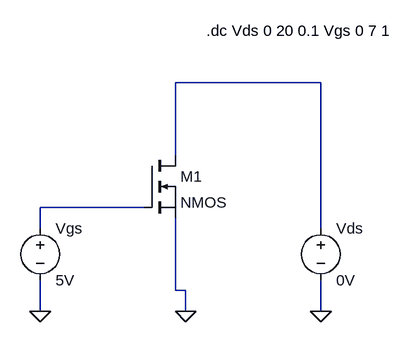
[diagram p0: schematic task 2.asc]
task 2.asc, the LTspice schematic file:
Version 4
SHEET 1 880 680
WIRE 400 0 176 0
WIRE 176 112 176 0
WIRE 128 192 -32 192
WIRE -32 224 -32 192
WIRE 400 224 400 0
WIRE 176 320 176 208
WIRE 192 320 176 320
WIRE -32 352 -32 304
WIRE 192 352 192 320
WIRE 400 352 400 304
FLAG -32 352 0
FLAG 192 352 0
FLAG 400 352 0
SYMBOL nmos 128 112 R0
SYMATTR InstName M1
SYMBOL voltage -32 208 R0
SYMATTR InstName Vgs
SYMATTR Value 5V
SYMBOL voltage 400 208 R0
SYMATTR InstName Vds
SYMATTR Value 0V
TEXT 224 -80 Left 2 !.dc Vds 0 20 0.1 Vgs 0 7 1

The netlist it stands for:
* task 2.asc
M1 N001 N002 0 0 NMOS
Vgs N002 0 5V
Vds N001 0 0V
.model NMOS NMOS
.model PMOS PMOS
.lib standard.mos
.dc Vds 0 20 0.1 Vgs 0 7 1
.backanno
.end